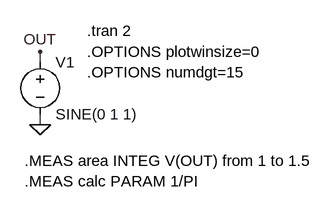
[diagram p0: schematic Fig_4-49_Integ_MEAS.asc]
Fig_4-49_Integ_MEAS.asc, the LTspice schematic file:
Version 4
SHEET 1 880 680
WIRE 128 128 128 112
WIRE 128 224 128 208
FLAG 128 224 0
FLAG 128 112 OUT
SYMBOL voltage 128 112 R0
WINDOW 123 0 0 Left 2
WINDOW 39 0 0 Left 2
SYMATTR InstName V1
SYMATTR Value SINE(0 1 1)
TEXT 200 80 Left 2 !.tran 2
TEXT 104 280 Left 2 !.MEAS area INTEG V(OUT) from 1 to 1.5\n.MEAS calc PARAM 1/PI
TEXT 200 112 Left 2 !.OPTIONS plotwinsize=0\n.OPTIONS numdgt=15

The netlist it stands for:
* Fig_4-49_Integ_MEAS.asc
V1 OUT 0 SINE(0 1 1)
.tran 2
.MEAS area INTEG V(OUT) from 1 to 1.5
.MEAS calc PARAM 1/PI
.OPTIONS plotwinsize=0
.OPTIONS numdgt=15
.backanno
.end